# EAGLE schematic Kompressor Steuerung (EAGLE 7.3.0)
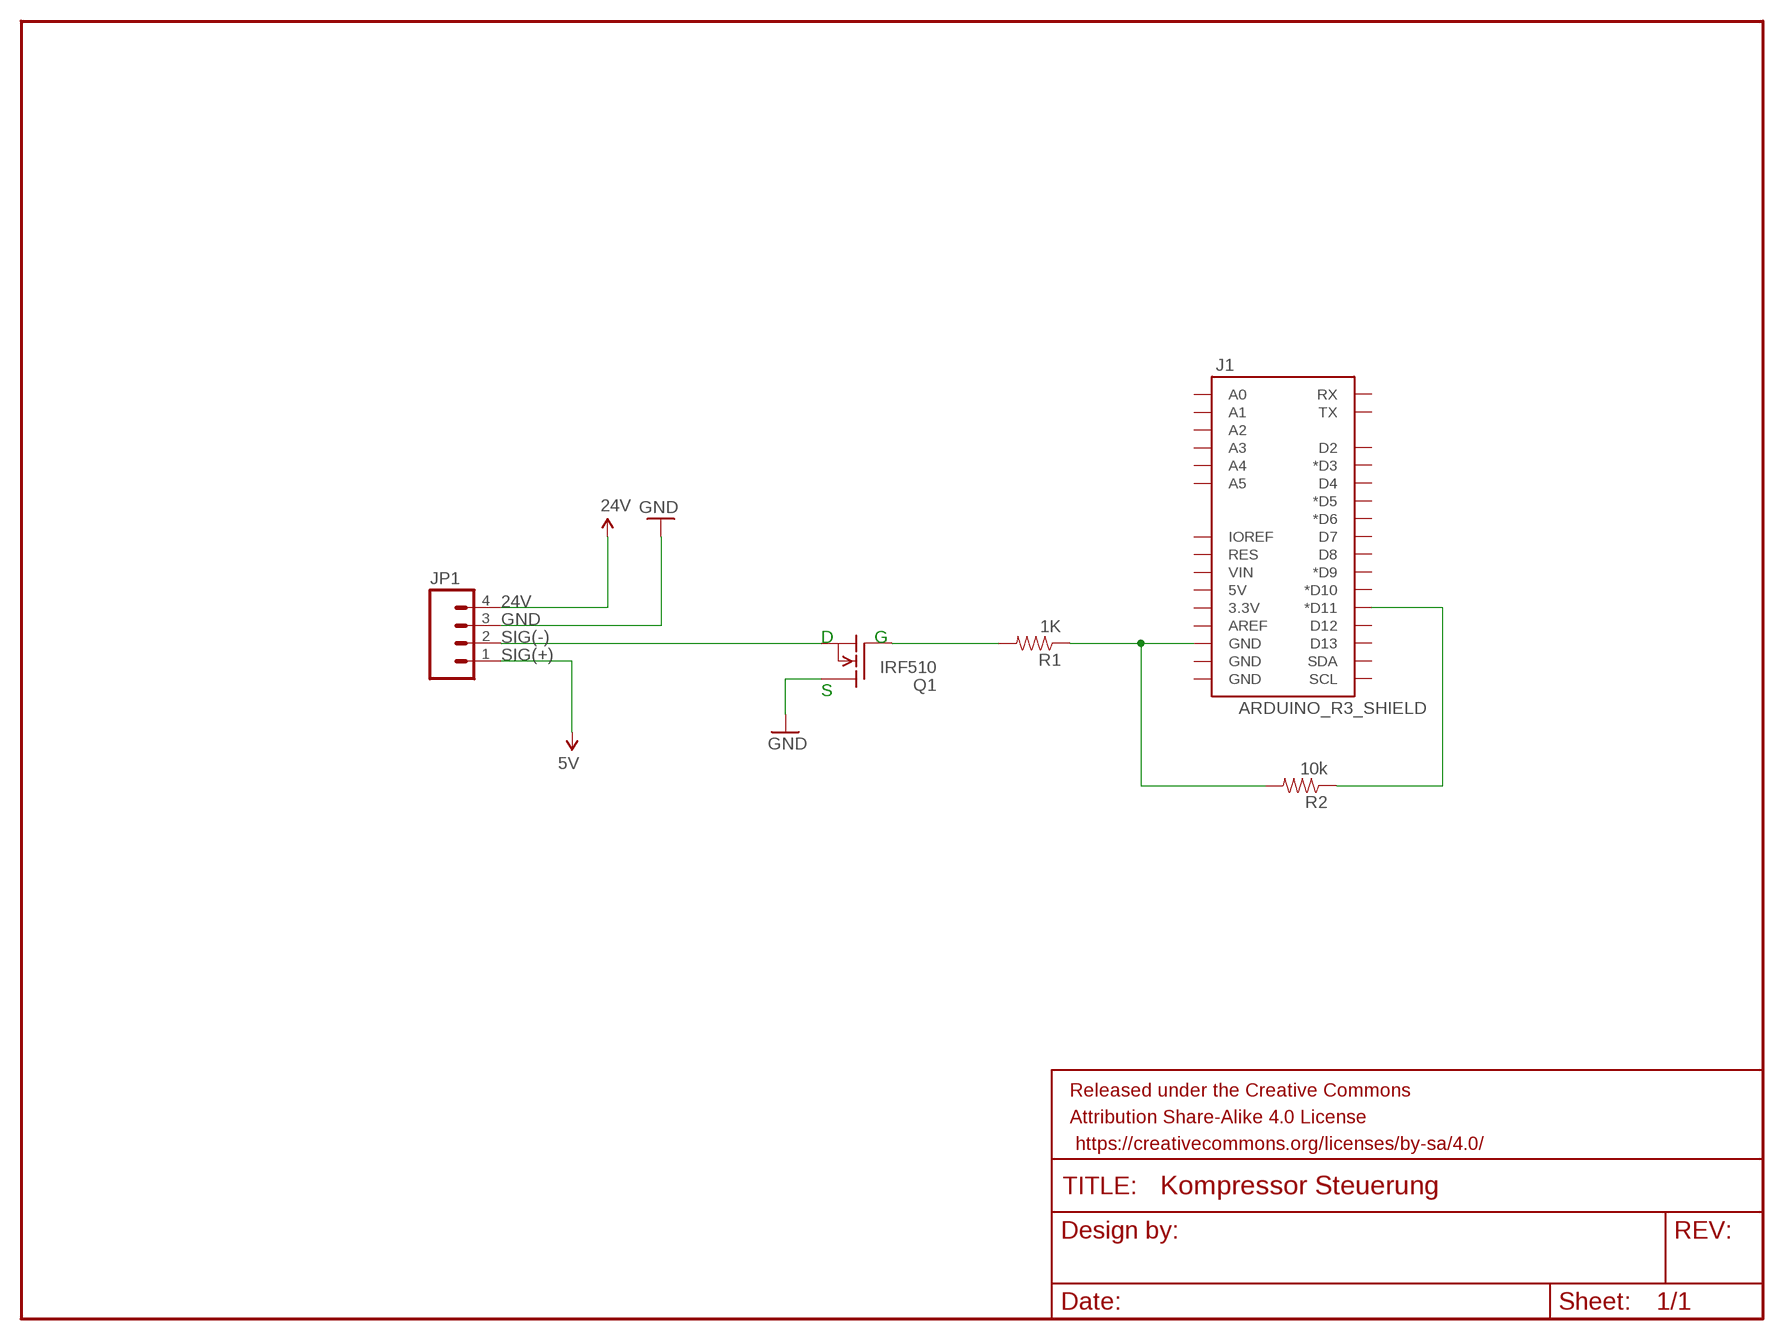
[diagram p0: schematic, sheet 1]

## Parts
FRAME1  FRAME-LETTER  [CREATIVE_COMMONS]
J1  ARDUINO_R3_SHIELD  [UNO_R3_SHIELD]
JP1  M04LOCK  [1X04_LOCK]
Q1  IRF510  [TO220]
R1  1K  1KOHM-1/4W-1%(PTH)  [AXIAL-0.3]
R2  10k  10KOHM-1/4W-1%(PTH)HORIZ  [AXIAL-0.3]

## Nets
24V: JP1.4
GND: JP1.3 Q1.2(D)
N$2: Q1.1(G) R1.P$2
N$3: J1.GND@2(GND) R1.P$1 R2.P$2
N$4: J1.D11(*D11) R2.P$1
SIG(+): JP1.1 ; supply symbol labelled 5V
SIG(-): JP1.2 Q1.3(S)
Unconnected: J1.3.3V J1.5V J1.A0 J1.A1 J1.A2 J1.A3 J1.A4 J1.A5 J1.AREF J1.D2 J1.D3(*D3) J1.D4 J1.D5(*D5) J1.D6(*D6) J1.D7 J1.D8 J1.D9(*D9) J1.D10(*D10) J1.D12 J1.D13 J1.GND@0(GND) J1.GND@1(GND) J1.IOREF J1.RES J1.RX J1.SCL J1.SDA J1.TX J1.VIN

## Notes on the sheet
- D | G
- S

## Library data of the parts
FRAME1 = SparkFun-Aesthetics:FRAME-LETTER: Schematic Frame Standard 8.5x11 US Letter frame; DESIGNER: NAME; VERSION: v01
J1 = SparkFun-Boards:ARDUINO_R3_SHIELD: Shield form compatible with the Arduino Uno R3.
JP1 = SparkFun-Connectors:M04: Header 4 Standard 4-pin 0.1" header. Use with straight break away headers (SKU : PRT-00116), right angle break away headers (PRT-00553), swiss pins (PRT-00743), machine pins (PRT-00117), and female headers (PRT-00115). Molex polarized connector foot print use with SKU : PRT-08231 with associated crimp pins and housings. 1MM SMD Version SKU: PRT-10208
Q1 = transistor-fet:IRF510: N-Channel Enhancement MOSFET (HEXFET); 100V; 5,6A; 0,54Ohm
R1 = SparkFun-Resistors:1KOHM-1/4W-1%(PTH): RES-12182; PROD_ID: RES-12182
R2 = SparkFun-Resistors:10KOHM-1/4W-1%(PTH): RES-12183; PROD_ID: RES-12183